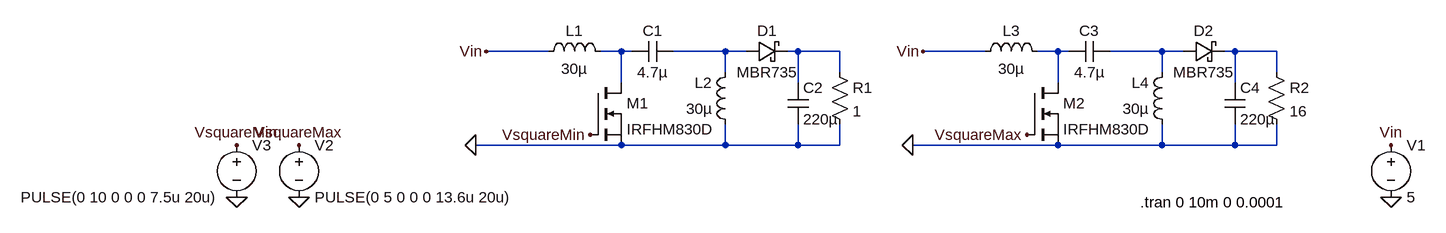
[diagram p0: schematic Simulacion.asc]
Simulacion.asc, the LTspice schematic file:
Version 4
SHEET 1 1484 1112
WIRE 128 128 32 128
WIRE 240 128 208 128
WIRE 256 128 240 128
WIRE 400 128 320 128
WIRE 432 128 400 128
WIRE 512 128 496 128
WIRE 576 128 512 128
WIRE 800 128 704 128
WIRE 912 128 880 128
WIRE 928 128 912 128
WIRE 1072 128 992 128
WIRE 1104 128 1072 128
WIRE 1184 128 1168 128
WIRE 1248 128 1184 128
WIRE 400 160 400 128
WIRE 576 160 576 128
WIRE 1072 160 1072 128
WIRE 1248 160 1248 128
WIRE 240 176 240 128
WIRE 512 176 512 128
WIRE 912 176 912 128
WIRE 1184 176 1184 128
WIRE 240 272 16 272
WIRE 400 272 400 240
WIRE 400 272 240 272
WIRE 512 272 512 240
WIRE 512 272 400 272
WIRE 576 272 576 240
WIRE 576 272 512 272
WIRE 912 272 688 272
WIRE 1072 272 1072 240
WIRE 1072 272 912 272
WIRE 1184 272 1184 240
WIRE 1184 272 1072 272
WIRE 1248 272 1248 240
WIRE 1248 272 1184 272
FLAG 32 128 Vin
FLAG 16 272 0
FLAG 192 256 VsquareMin
FLAG -256 272 VsquareMax
FLAG 1424 272 Vin
FLAG -256 352 0
FLAG 1424 352 0
FLAG 704 128 Vin
FLAG 688 272 0
FLAG 864 256 VsquareMax
FLAG -352 272 VsquareMin
FLAG -352 352 0
SYMBOL ind 112 144 R270
WINDOW 0 32 56 VTop 2
WINDOW 3 5 56 VBottom 2
SYMATTR InstName L1
SYMATTR Value 30µ
SYMBOL ind 416 256 R180
WINDOW 0 36 80 Left 2
WINDOW 3 36 40 Left 2
SYMATTR InstName L2
SYMATTR Value 30µ
SYMBOL cap 320 112 R90
WINDOW 0 0 32 VBottom 2
WINDOW 3 32 32 VTop 2
SYMATTR InstName C1
SYMATTR Value 4.7µ
SYMBOL cap 496 176 R0
SYMATTR InstName C2
SYMATTR Value 220µ
SYMBOL res 560 144 R0
SYMATTR InstName R1
SYMATTR Value 1
SYMBOL nmos 192 176 R0
SYMATTR InstName M1
SYMATTR Value IRFHM830D
SYMBOL voltage 1424 256 R0
WINDOW 123 0 0 Left 2
WINDOW 39 0 0 Left 2
SYMATTR InstName V1
SYMATTR Value 5
SYMBOL voltage -256 256 R0
WINDOW 123 0 0 Left 2
WINDOW 39 0 0 Left 2
SYMATTR InstName V2
SYMATTR Value PULSE(0 5 0 0 0 13.6u 20u)
SYMBOL schottky 432 144 R270
WINDOW 0 32 32 VTop 2
WINDOW 3 0 32 VBottom 2
SYMATTR InstName D1
SYMATTR Value MBR735
SYMBOL ind 784 144 R270
WINDOW 0 32 56 VTop 2
WINDOW 3 5 56 VBottom 2
SYMATTR InstName L3
SYMATTR Value 30µ
SYMBOL ind 1088 256 R180
WINDOW 0 36 80 Left 2
WINDOW 3 36 40 Left 2
SYMATTR InstName L4
SYMATTR Value 30µ
SYMBOL cap 992 112 R90
WINDOW 0 0 32 VBottom 2
WINDOW 3 32 32 VTop 2
SYMATTR InstName C3
SYMATTR Value 4.7µ
SYMBOL cap 1168 176 R0
SYMATTR InstName C4
SYMATTR Value 220µ
SYMBOL res 1232 144 R0
SYMATTR InstName R2
SYMATTR Value 16
SYMBOL nmos 864 176 R0
SYMATTR InstName M2
SYMATTR Value IRFHM830D
SYMBOL schottky 1104 144 R270
WINDOW 0 32 32 VTop 2
WINDOW 3 0 32 VBottom 2
SYMATTR InstName D2
SYMATTR Value MBR735
SYMBOL voltage -352 256 R0
WINDOW 3 -332 96 Left 2
WINDOW 123 0 0 Left 2
WINDOW 39 0 0 Left 2
SYMATTR InstName V3
SYMATTR Value PULSE(0 10 0 0 0 7.5u 20u)
TEXT 1038 360 Left 2 !.tran 0 10m 0 0.0001

The netlist it stands for:
* Simulacion.asc
L1 Vin N001 30µ
L2 0 N002 30µ
C1 N002 N001 4.7µ
C2 N003 0 220µ
R1 N003 0 1
M1 N001 VsquareMin 0 0 IRFHM830D
V1 Vin 0 5
V2 VsquareMax 0 PULSE(0 5 0 0 0 13.6u 20u)
D1 N002 N003 MBR735
L3 Vin N004 30µ
L4 0 N005 30µ
C3 N005 N004 4.7µ
C4 N006 0 220µ
R2 N006 0 16
M2 N004 VsquareMax 0 0 IRFHM830D
D2 N005 N006 MBR735
V3 VsquareMin 0 PULSE(0 10 0 0 0 7.5u 20u)
.model D D
.lib standard.dio
.model NMOS NMOS
.model PMOS PMOS
.lib standard.mos
.tran 0 10m 0 0.0001
.backanno
.end